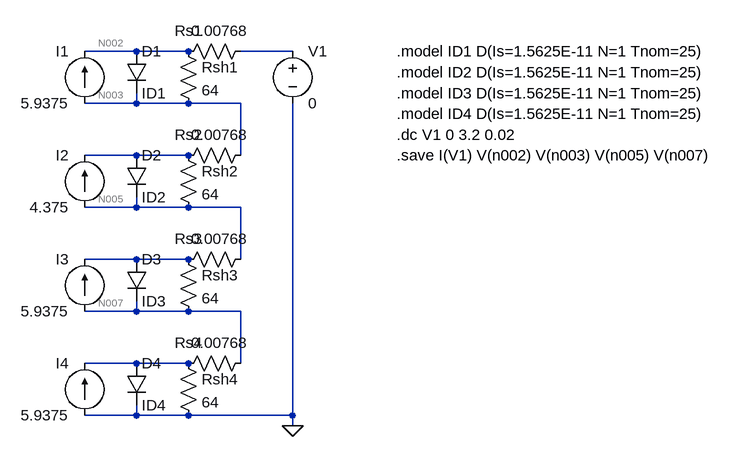
[diagram p0: schematic DiodeModel.asc]
DiodeModel.asc, the LTspice schematic file:
Version 4
SHEET 1 880 680
WIRE 240 0 320 0
WIRE 0 0 80 0
WIRE 80 0 160 0
WIRE 0 80 80 80
WIRE 80 80 160 80
WIRE 80 64 80 80
WIRE 160 80 240 80
WIRE 240 80 240 160
WIRE 0 160 80 160
WIRE 80 160 160 160
WIRE 0 240 80 240
WIRE 80 240 160 240
WIRE 80 224 80 240
WIRE 160 240 240 240
WIRE 240 240 240 320
WIRE 0 320 80 320
WIRE 80 320 160 320
WIRE 0 400 80 400
WIRE 80 400 160 400
WIRE 80 384 80 400
WIRE 160 400 240 400
WIRE 240 400 240 480
WIRE 0 480 80 480
WIRE 80 480 160 480
WIRE 0 560 80 560
WIRE 80 560 160 560
WIRE 80 544 80 560
WIRE 160 560 320 560
WIRE 320 560 320 576
WIRE 320 80 320 560
FLAG 320 576 0
SYMBOL current 0 80 R180
WINDOW 0 24 80 Left 2
WINDOW 3 24 0 Left 2
SYMATTR InstName I1
SYMATTR Value 5.9375
SYMBOL diode 64 0 R0
SYMATTR InstName D1
SYMATTR Value ID1
SYMBOL res 144 16 R270
WINDOW 0 32 16 VTop 2
WINDOW 3 32 64 VTop 2
SYMATTR InstName Rs1
SYMATTR Value 0.00768
SYMBOL res 144 -16 R0
SYMATTR InstName Rsh1
SYMATTR Value 64
SYMBOL current 0 240 R180
WINDOW 0 24 80 Left 2
WINDOW 3 24 0 Left 2
SYMATTR InstName I2
SYMATTR Value 4.375
SYMBOL diode 64 160 R0
SYMATTR InstName D2
SYMATTR Value ID2
SYMBOL res 144 176 R270
WINDOW 0 32 16 VTop 2
WINDOW 3 32 64 VTop 2
SYMATTR InstName Rs2
SYMATTR Value 0.00768
SYMBOL res 144 144 R0
SYMATTR InstName Rsh2
SYMATTR Value 64
SYMBOL current 0 400 R180
WINDOW 0 24 80 Left 2
WINDOW 3 24 0 Left 2
SYMATTR InstName I3
SYMATTR Value 5.9375
SYMBOL diode 64 320 R0
SYMATTR InstName D3
SYMATTR Value ID3
SYMBOL res 144 336 R270
WINDOW 0 32 16 VTop 2
WINDOW 3 32 64 VTop 2
SYMATTR InstName Rs3
SYMATTR Value 0.00768
SYMBOL res 144 304 R0
SYMATTR InstName Rsh3
SYMATTR Value 64
SYMBOL current 0 560 R180
WINDOW 0 24 80 Left 2
WINDOW 3 24 0 Left 2
SYMATTR InstName I4
SYMATTR Value 5.9375
SYMBOL diode 64 480 R0
SYMATTR InstName D4
SYMATTR Value ID4
SYMBOL res 144 496 R270
WINDOW 0 32 16 VTop 2
WINDOW 3 32 64 VTop 2
SYMATTR InstName Rs4
SYMATTR Value 0.00768
SYMBOL res 144 464 R0
SYMATTR InstName Rsh4
SYMATTR Value 64
SYMBOL voltage 320 -16 R0
SYMATTR InstName V1
SYMATTR Value 0
TEXT 480 0 Left 2 !.model ID1 D(Is=1.5625E-11 N=1 Tnom=25)
TEXT 480 32 Left 2 !.model ID2 D(Is=1.5625E-11 N=1 Tnom=25)
TEXT 480 64 Left 2 !.model ID3 D(Is=1.5625E-11 N=1 Tnom=25)
TEXT 480 96 Left 2 !.model ID4 D(Is=1.5625E-11 N=1 Tnom=25)
TEXT 480 128 Left 2 !.dc V1 0 3.2 0.02
TEXT 480 160 Left 2 !.save I(V1) V(n002) V(n003) V(n005) V(n007)

The netlist it stands for:
* DiodeModel.asc
I1 N003 N002 5.9375
D1 N002 N003 ID1
Rs1 N002 N001 0.00768
Rsh1 N002 N003 64
I2 N005 N004 4.375
D2 N004 N005 ID2
Rs2 N004 N003 0.00768
Rsh2 N004 N005 64
I3 N007 N006 5.9375
D3 N006 N007 ID3
Rs3 N006 N005 0.00768
Rsh3 N006 N007 64
I4 0 N008 5.9375
D4 N008 0 ID4
Rs4 N008 N007 0.00768
Rsh4 N008 0 64
V1 N001 0 0
.model D D
.lib standard.dio
.model ID1 D(Is=1.5625E-11 N=1 Tnom=25)
.model ID2 D(Is=1.5625E-11 N=1 Tnom=25)
.model ID3 D(Is=1.5625E-11 N=1 Tnom=25)
.model ID4 D(Is=1.5625E-11 N=1 Tnom=25)
.dc V1 0 3.2 0.02
.save I(V1) V(n002) V(n003) V(n005) V(n007)
.backanno
.end